# Altium schematic sheet 6301 Lab3 ADC.SchDoc: Dual-Slope ADC
size Letter; Author: M. Holachek; Revision: 1; SheetNumber: 3; SheetTotal: 3
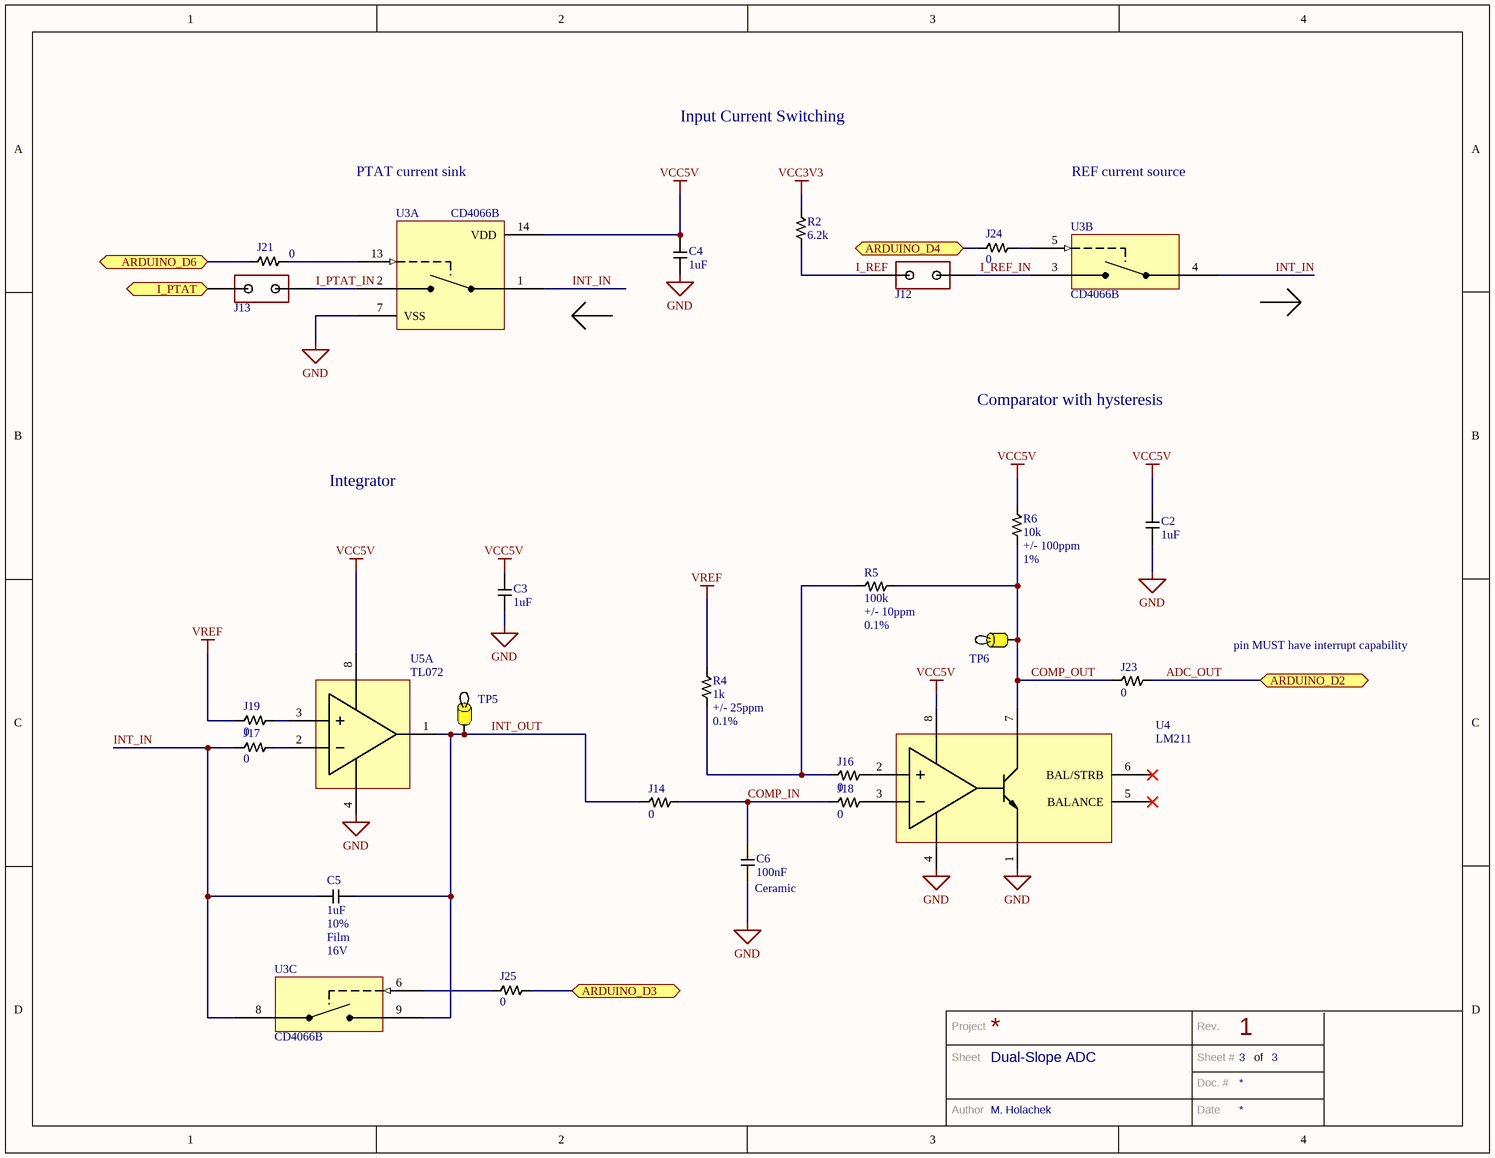
[diagram p0: 6301 Lab3 ADC.SchDoc]

## Parts
C2  1uF  [CAP0805]
C3  1uF  [CAP0805]
C4  1uF  [CAP0805]
C5  1uF  Tolerance: 10%  Type: Film  Voltage: 16V  [CAP0805]
C6  100nF  Type: Ceramic  [CAP0805]
J12  Jumper  [1X02]  (value not drawn)
J13  Jumper  [1X02]  (value not drawn)
J14  0  [JUMP0402]
J16  0  [JUMP0402]
J17  0  [JUMP0402]
J18  0  [JUMP0402]
J19  0  [JUMP0402]
J21  0  [JUMP0402]
J23  0  [JUMP0402]
J24  0  [JUMP0402]
J25  0  [JUMP0402]
R2  6.2k  [RES0805]
R4  1k  Temp Co: +/- 25ppm  Tolerance: 0.1%  [RES0805]
R5  100k  Temp Co: +/- 10ppm  Tolerance: 0.1%  [RES0805]
R6  10k  Temp Co: +/- 100ppm  Tolerance: 1%  [RES0805]
TP5  Yellow  [TP_YELLOW]  (value not drawn)
TP6  Yellow  [TP_YELLOW]  (value not drawn)
U3  CD4066B  [SOIC14]  (parts A,B,C of 4)
U4  LM211  [SOIC8]
U5  TL072  [SOIC8]  (part A of 2)

## Ports
ARDUINO_D2, ARDUINO_D3, ARDUINO_D4, ARDUINO_D6, I_PTAT (out)

## Nets
GND: C2.1 C3.1 C4.1 C6.1 U3.7(VSS) U4.1(EMIT_OUT) U4.4(VCC-) U5.4(VCC-)
VCC3V3: R2.2
VCC5V: C2.2 C3.2 C4.2 R6.2 U3.14(VDD) U4.8(VCC+) U5.8(VCC+)
VREF: J19.1 R4.2
ADC_OUT: J23.1 ; port ARDUINO_D2
ARDUINO_D3: J25.2 ; port ARDUINO_D3
ARDUINO_D4: J24.1 ; port ARDUINO_D4
ARDUINO_D6: J21.1 ; port ARDUINO_D6
COMP_IN: C6.2 J14.1 J18.2
COMP_OUT: J23.2 R5.1 R6.1 TP6.1 U4.7(COL_OUT)
I_PTAT: J13.2 ; port I_PTAT
I_PTAT_IN: J13.1 U3.2(OUT_A)
I_REF: J12.2 R2.1
I_REF_IN: J12.1 U3.3(OUT_B)
INT_IN: C5.1 J17.1 U3.1(IN_A) U3.4(IN_B) U3.8(IN_C)
INT_OUT: C5.2 J14.2 TP5.1 U3.9(OUT_C) U5.1(1OUT)
NetJ16_1: J16.1 U4.2(IN+)
NetJ16_2: J16.2 R4.1 R5.2
NetJ17_2: J17.2 U5.2(1IN-)
NetJ18_1: J18.1 U4.3(IN-)
NetJ19_2: J19.2 U5.3(1IN+)
NetJ21_2: J21.2 U3.13(EN_A)
NetJ24_2: J24.2 U3.5(EN_B)
NetJ25_1: J25.1 U3.6(EN_C)

Not connected (* = marked no-connect by the designer): U4 5(BALANCE)* 6(BAL/STRB)*

## Notes on the sheet
- Input Current Switching
- PTAT current sink
- REF current source
- Comparator with hysteresis
- Integrator
- pin MUST have interrupt capability
- Project
- Rev.
- Sheet
- Author
- Doc. #
- Sheet #
- Date
- of

## Library data of the parts
C2-C4 = Capacitor: Capacitor, 0805 Package; Tolerance: 10%; Type: Ceramic; Voltage: 25V
C5 = Capacitor: Capacitor, 0805 Package
C6 = Capacitor: Capacitor, 0805 Package; Tolerance: 10%; Voltage: 50V; Digikey P/N: 399-1147-1-ND
J12 J13 = 1x2: 1x2 2.54mm Jumper
J14 J16-J19 J21 J23-J25 = Jumper 0402: Jumper, 0402 Package
R2 = Resistor: Resistor, 0805 Package; Temp Co: +/- 10ppm; Tolerance: 0.1%; Digikey P/N: A103679CT-ND
R4-R6 = Resistor: Resistor, 0805 Package
  R4: Digikey P/N: RG20P499KBCT-ND
  R5: Digikey P/N: A103679CT-ND
  R6: Digikey P/N: RMCF0805FT10K0CT-ND
TP5 TP6 = Yellow Test Point
U3 = CD4066B: CMOS Quad Bilateral Switch; Manufacturer P/N: CD4066BEE4; Manufacturer: Texas Instruments; Current Rating: 10mA; Output Voltage Range: 3-18V; Operating Temperature: -55C to 125C; Digikey P/N: 296-36088-5-ND
U4 = LMx11: Single Differential Comparator; Manufacturer P/N: LM311N; Manufacturer: Texas Instruments; Operating Temperature: 0C to 70C; Digikey P/N: LM311N-ND
U5 = TL07xx: Dual Low-Noise JFET-Input Op Amp